# Altium schematic sheet Sheet2.SchDoc
size A; SheetNumber: 3; SheetTotal: 3
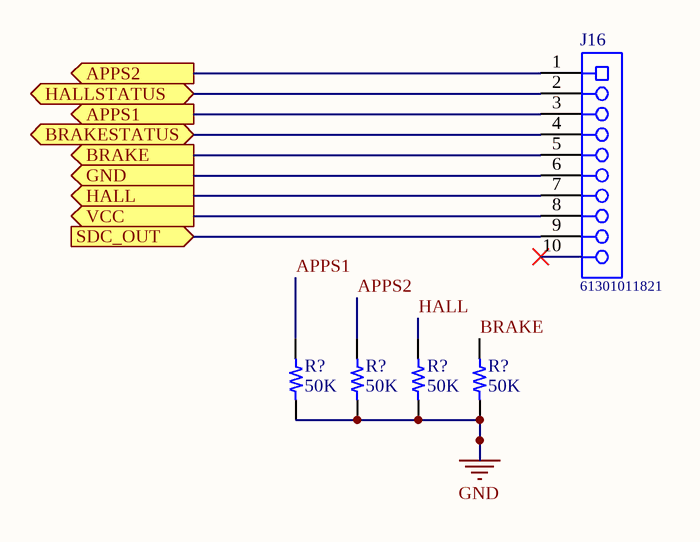
[diagram p0: Sheet2.SchDoc]

## Parts
(Parts that share a designator on the sheet are numbered #1, #2 ... from top to bottom, then left to right.)
J16  61301011821  [61301011821]
R?#1  50K  [RES 0603_1608]
R?#2  50K  [RES 0603_1608]
R?#3  50K  [RES 0603_1608]
R?#4  50K  [RES 0603_1608]

## Ports
APPS1 (out), APPS2 (out), BRAKE (out), BRAKESTATUS (bidir), GND (out), HALL (out), HALLSTATUS (bidir), SDC_OUT (in), VCC (out)

## Nets
GND: R?#1.2 R?#2.2 R?#3.2 R?#4.2
APPS1: J16.3 ; port APPS1
APPS1: R?#1.1  [a separate net that carries the same name]
APPS2: J16.1 ; port APPS2
APPS2: R?#2.1  [a separate net that carries the same name]
BRAKE: J16.5 ; port BRAKE
BRAKE: R?#4.1  [a separate net that carries the same name]
BRAKESTATUS: J16.4 ; port BRAKESTATUS
GND: J16.6 ; port GND  [a separate net that carries the same name]
HALL: J16.7 ; port HALL
HALL: R?#3.1  [a separate net that carries the same name]
HALLSTATUS: J16.2 ; port HALLSTATUS
SDC_OUT: J16.9 ; port SDC_OUT
VCC: J16.8 ; port VCC

Not connected (* = marked no-connect by the designer): J16 10*

## Library data of the parts
J16 = CMP-1502-01332-1: THT Vertical Socket Header WR-PHD, Pitch 2.54 mm, Single Row, 10 pins; Manufacturer: Wurth Elektronik; Rated Current: 3A; Working Voltage: 250VAC; Gender: Female; Pitch: 2.54mm; Contact Resistance: 20mOhm; Pin Number: 10; Withstanding Voltage: 500VAC; Publisher: WurthElektronik; Orientation: Vertical; Row Number: Single; Package Reference: 61301011821; Packaging: Tray; Datasheet URL: https://katalog.we-online.de/em/datasheet/6130xx11821.pdf; Operating Temperature: -40to125degC; Part Number: 61301011821; Manufacturer URL: http://www.we-online.de; Mounting Technology: THT
R?#1-R?#4 = CRGP0603F5K6: CRGP 0603 5K6 1%; Manufacturer: TE Connectivity Passive Product; Power (Watts): 0.25W, 1/4W; Resistance: 50KOHM; Temperature Coefficient: ±100ppm/°C; Part Number: CRGP0603F5K6; Value: 50K; ComponentLink1Description: Datasheet; ComponentLink1URL: https://www.te.com/commerce/DocumentDelivery/DDEController?Action=srchrtrv&DocNm=9-1773463-9&DocType=DS&DocLang=English; ComponentLink2Description: DigiKey Link; ComponentLink2URL: http://digikey.com/product-detail/en/te-connectivity-passive-product/CRGP0603F5K6/A130425CT-ND/8578257; Composition: Thick Film; Device Package: 0603 (1608 Metric); Features: Pulse Withstanding; Height - Seated (Max): 0.022" (0.55mm); LastUpdated: 9/2/2020 1:09:50 AM; Lifecycle Status: Active; Minimum Order: 1; Number of Terminations: 2; Operating Temperature: -55°C ~ 155°C; Package / Case: 0603 (1608 Metric); Packaging: TapeAndReel; PartId: 20907; Part Status: Active; Price: 0.02; Series: CRGP; Size / Dimension: 0.063" L x 0.031" W (1.60mm x 0.80mm); Supplier 1: DigiKey; Supplier Part Number 1: A130425CT-ND; Supplier Device Package: 0603; Tolerance: ±1%